# Altium schematic sheet 1_01 MCU.SchDoc.schdoc
size 441 x 187 mm; Name: A_Customize; Symbol: A_Customize; Device: A_Customize; @Project Name: 01 MCU.SchDoc; REV: 1.0; Date: 2024-05-14; Sheet: 1/1; Draw By: TheConquerK; Company: NEU-REAL-LAB; Convert to PCB: yes; Add into BOM: yes; SheetNumber: 1; SheetTotal: 3
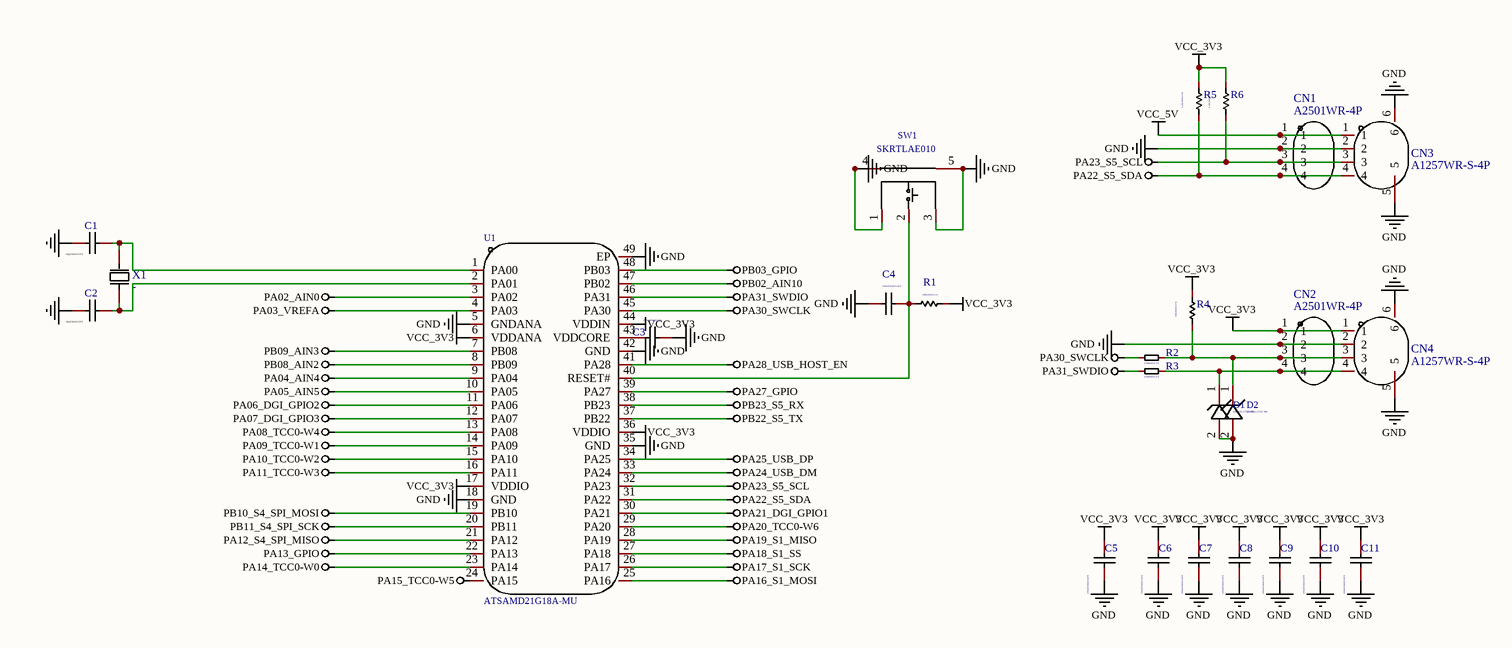
[diagram p0: 1_01 MCU.SchDoc.schdoc]

## Parts
C1  18pF/0402/50V  [C0402]  (value not drawn)
C2  18pF/0402/50V  [C0402]  (value not drawn)
C3  100nF/0603/50V  [C0402]
C4  100nF/0402/50V  [C0402]
C5  100nF/0603/50V  [C0402]
C6  100nF/0603/50V  [C0402]
C7  100nF/0603/50V  [C0402]
C8  100nF/0603/50V  [C0402]
C9  100nF/0603/50V  [C0402]
C10  100nF/0603/50V  [C0402]
C11  100nF/0603/50V  [C0402]
CN1  A2501WR-4P  [CONN-TH_A2501WR-4P]
CN2  A2501WR-4P  [CONN-TH_A2501WR-4P]
CN3  A1257WR-S-4P  [CONN-SMD_A1257WR-S-4P]
CN4  A1257WR-S-4P  [CONN-SMD_A1257WR-S-4P]
D1  ESD5Z3.3T1G-MS  [SOD-523]
D2  ESD5Z3.3T1G-MS  [SOD-523]
R1  10K/0402/1%  [R0402]
R2  22R/0402/1%  [R0402]
R3  22R/0402/1%  [R0402]
R4  10K/0402/1%  [R0402]
R5  2.2K/0402/1%  [R0402]
R6  2.2K/0402/1%  [R0402]
SW1  SKRTLAE010  [KEY-SMD_SKRTLAE010]
U1  ATSAMD21G18A-MU  [QFN-48_L7.0-W7.0-P0.50-TL-EP5.1]
X1  -  [OSC-SMD_L3.2-W1.5]

## Nets
GND: C1.2 C2.2 C3.2 C4.1 C5.2 C6.2 C7.2 C8.2 C9.2 C10.2 C11.2 CN1.2 CN2.2 CN3.2 CN3.5 CN3.6 CN4.2 CN4.5 CN4.6 D1.2(A) D2.2(A) SW1.1 SW1.3 SW1.4 SW1.5 U1.5(GNDANA) U1.18(GND) U1.35(GND) U1.42(GND) U1.49(EP)
PA02_AIN0: U1.3(PA02)
PA03_VREFA: U1.4(PA03)
PA04_AIN4: U1.9(PA04)
PA05_AIN5: U1.10(PA05)
PA06_DGI_GPIO2: U1.11(PA06)
PA07_DGI_GPIO3: U1.12(PA07)
PA08_TCC0-W4: U1.13(PA08)
PA09_TCC0-W1: U1.14(PA09)
PA10_TCC0-W2: U1.15(PA10)
PA11_TCC0-W3: U1.16(PA11)
PA12_S4_SPI_MISO: U1.21(PA12)
PA13_GPIO: U1.22(PA13)
PA14_TCC0-W0: U1.23(PA14)
PA15_TCC0-W5: U1.24(PA15)
PA16_S1_MOSI: U1.25(PA16)
PA17_S1_SCK: U1.26(PA17)
PA18_S1_SS: U1.27(PA18)
PA19_S1_MISO: U1.28(PA19)
PA20_TCC0-W6: U1.29(PA20)
PA21_DGI_GPIO1: U1.30(PA21)
PA22_S5_SDA: CN1.4 CN3.4 R5.1 U1.31(PA22)
PA23_S5_SCL: CN1.3 CN3.3 R6.1 U1.32(PA23)
PA24_USB_DM: U1.33(PA24)
PA25_USB_DP: U1.34(PA25)
PA27_GPIO: U1.39(PA27)
PA28_USB_HOST_EN: U1.41(PA28)
PA30_SWCLK: R2.1 U1.45(PA30)
PA31_SWDIO: R3.1 U1.46(PA31)
PB02_AIN10: U1.47(PB02)
PB03_GPIO: U1.48(PB03)
PB08_AIN2: U1.8(PB09)
PB09_AIN3: U1.7(PB08)
PB10_S4_SPI_MOSI: U1.19(PB10)
PB11_S4_SPI_SCK: U1.20(PB11)
PB22_S5_TX: U1.37(PB22)
PB23_S5_RX: U1.38(PB23)
VCC_3V3: C5.1 C6.1 C7.1 C8.1 C9.1 C10.1 C11.1 CN2.1 CN4.1 R1.2 R4.2 R5.2 R6.2 U1.6(VDDANA) U1.17(VDDIO) U1.36(VDDIO) U1.44(VDDIN)
VCC_5V: CN1.1 CN3.1
NetC1_1: C1.1 U1.1(PA00) X1.2(OSC2)
NetC2_1: C2.1 U1.2(PA01) X1.1(OSC1)
NetC3_1: C3.1 U1.43(VDDCORE)
NetC4_2: C4.2 R1.1 SW1.2 U1.40(RESET#)
NetCN2_3: CN2.3 CN4.3 D2.1(C) R2.2 R4.1
NetCN2_4: CN2.4 CN4.4 D1.1(C) R3.2

## Notes on the sheet
- 1
- 2
- 3
- 4
- 5
- A
- B
- TITLE:
- 01 MCU.SchDoc
- REV:
- 1.0
- Date:
- Company:
- 2024-05-14
- NEU-REAL-LAB
- Drawn By:
- TheConquerK
- Sheet:
- 1/1

## Library data of the parts
C1 C2 = 18pF/0402/50V: Convert to PCB: yes; Name: 18pF/0402/50V; Symbol: 18pF/0402/50V; Device: 18pF/0402/50V; Published: 8-Jun-2000; LatestRevisionDate: 17-Jul-2002; LatestRevisionNote: Re-released for DXP Platform.; PackageReference: RAD-0.3; Publisher: Altium Limited; PackageDescription: Radial Cap, Thru-Hole; 2 Leads; 0.3 in Pin Spacing; Add into BOM: yes; Origin Footprint: C0402
C3 C5-C11 = 100nF/0603/50V: Convert to PCB: yes; Name: 100nF/0603/50V; Symbol: 100nF/0603/50V; Device: 100nF/0603/50V; Published: 8-Jun-2000; LatestRevisionDate: 17-Jul-2002; LatestRevisionNote: Re-released for DXP Platform.; PackageReference: RAD-0.3; Publisher: Altium Limited; PackageDescription: Radial Cap, Thru-Hole; 2 Leads; 0.3 in Pin Spacing; Add into BOM: yes; Origin Footprint: C0402
C4 = 100nF/0402/50V: Convert to PCB: yes; Name: 100nF/0402/50V; Symbol: 100nF/0402/50V; Device: 100nF/0402/50V; Published: 8-Jun-2000; LatestRevisionDate: 17-Jul-2002; LatestRevisionNote: Re-released for DXP Platform.; PackageReference: RAD-0.3; Publisher: Altium Limited; PackageDescription: Radial Cap, Thru-Hole; 2 Leads; 0.3 in Pin Spacing; Add into BOM: yes; Origin Footprint: C0402
CN1 CN2 = A2501WR-4P: Manufacturer: CJT(长江连接器); Convert to PCB: yes; Name: A2501WR-4P; Symbol: A2501WR-4P; Device: A2501WR-4P; Supplier: LCSC; Supplier Part: C225401; Manufacturer Part: A2501WR-4P; JLCPCB Part Class: Extended Part; Add into BOM: yes; Origin Footprint: CONN-TH_A2501WR-4P
CN3 CN4 = A1257WR-S-4P: Manufacturer: CJT(长江连接器); Convert to PCB: yes; Name: A1257WR-S-4P; Symbol: A1257WR-S-4P; Device: A1257WR-S-4P; Supplier: LCSC; Supplier Part: C225127; Manufacturer Part: A1257WR-S-4P; JLCPCB Part Class: Extended Part; Add into BOM: yes; Origin Footprint: CONN-SMD_A1257WR-S-4P
D1 D2 = ESD5Z3.3T1G-MS: Manufacturer: MDD（Microdiode Electronics）; Manufacturer Part: ESD5Z5V0; Convert to PCB: yes; Name: ESD5Z3.3T1G-MS; Symbol: ESD5Z3.3T1G-MS; Device: ESD5Z3.3T1G-MS; Supplier: LCSC; Supplier Part: C502546; JLCPCB Part Class: Extended Part; Add into BOM: yes; Origin Footprint: SOD-523
R1 R4 = 10K/0402/1%: Convert to PCB: yes; Name: 10K/0402/1%; Symbol: 10K/0402/1%; Device: 10K/0402/1%; Published: 8-Jun-2000; LatestRevisionDate: 17-Jul-2002; LatestRevisionNote: Re-released for DXP Platform.; PackageReference: AXIAL-0.5; Publisher: Altium Limited; PackageDescription: Axial Device, Thru-Hole; 2 Leads; 0.5 in Pin Spacing; Add into BOM: yes; Origin Footprint: R0402
R2 R3 = 22R/0402/1%: Convert to PCB: yes; Name: 22R/0402/1%; Symbol: 22R/0402/1%; Device: 22R/0402/1%; Add into BOM: yes; Origin Footprint: R0402
R5 R6 = 2.2K/0402/1%: Convert to PCB: yes; Name: 2.2K/0402/1%; Symbol: 2.2K/0402/1%; Device: 2.2K/0402/1%; Published: 8-Jun-2000; LatestRevisionDate: 17-Jul-2002; LatestRevisionNote: Re-released for DXP Platform.; PackageReference: AXIAL-0.5; Publisher: Altium Limited; PackageDescription: Axial Device, Thru-Hole; 2 Leads; 0.5 in Pin Spacing; Add into BOM: yes; Origin Footprint: R0402
SW1 = SKRTLAE010: Manufacturer: ALPS; Convert to PCB: yes; Name: SKRTLAE010; Symbol: SKRTLAE010; Device: SKRTLAE010; Supplier: LCSC; Manufacturer Part: SKRTLAE010; Supplier Part: C110293; JLCPCB Part Class: Extended Part; Add into BOM: yes; Origin Footprint: KEY-SMD_SKRTLAE010
U1 = ATSAMD21G18A-MU: Manufacturer: MICROCHIP(美国微芯); Convert to PCB: yes; Name: ATSAMD21G18A-MU; Symbol: ATSAMD21G18A-MU; Device: ATSAMD21G18A-MU; Supplier: LCSC; Supplier Part: C966903; Manufacturer Part: ATSAMD21G18A-MU; JLCPCB Part Class: Extended Part; Add into BOM: yes; Origin Footprint: QFN-48_L7.0-W7.0-P0.50-TL-EP5.1
X1 = -: Manufacturer: KDS(大真空); Manufacturer Part: DST310S 32.768KHz; Convert to PCB: yes; Name: -; Symbol: -; Device: -; Supplier: LCSC; Supplier Part: C93232; JLCPCB Part Class: Extended Part; Add into BOM: yes; Origin Footprint: OSC-SMD_L3.2-W1.5